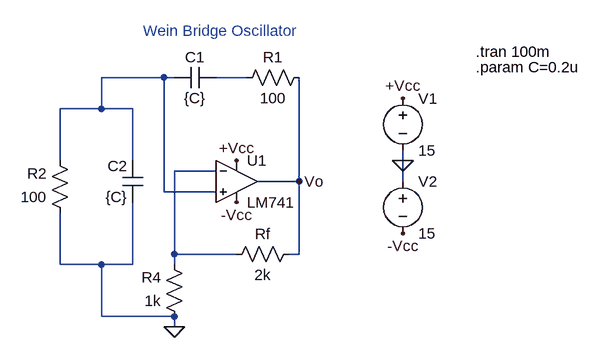
[diagram p0: schematic Wein Bridge.asc]
Wein Bridge.asc, the LTspice schematic file:
Version 4
SHEET 1 880 680
WIRE 96 0 0 0
WIRE 112 0 96 0
WIRE 224 0 176 0
WIRE 0 48 0 0
WIRE 0 48 -64 48
WIRE 48 48 0 48
WIRE -64 128 -64 48
WIRE 48 128 48 48
WIRE 464 128 464 112
WIRE 176 144 112 144
WIRE 304 160 304 0
WIRE 304 160 240 160
WIRE 464 160 464 128
WIRE 96 176 96 0
WIRE 176 176 96 176
WIRE 112 272 112 144
WIRE 208 272 112 272
WIRE 304 272 304 160
WIRE 304 272 288 272
WIRE -64 288 -64 208
WIRE 0 288 -64 288
WIRE 48 288 48 192
WIRE 48 288 0 288
WIRE 112 288 112 272
WIRE 0 368 0 288
WIRE 112 368 0 368
WIRE 112 384 112 368
FLAG 464 128 0
FLAG 464 32 +Vcc
FLAG 208 128 +Vcc
FLAG 464 240 -Vcc
FLAG 208 192 -Vcc
FLAG 304 160 Vo
FLAG 112 384 0
SYMBOL Opamps\\LM741 208 96 R0
SYMATTR InstName U1
SYMBOL voltage 464 16 R0
SYMATTR InstName V1
SYMATTR Value 15
SYMBOL voltage 464 144 R0
SYMATTR InstName V2
SYMATTR Value 15
SYMBOL cap 176 -16 R90
WINDOW 0 0 32 VBottom 2
WINDOW 3 32 32 VTop 2
SYMATTR InstName C1
SYMATTR Value {C}
SYMBOL cap 64 192 R180
WINDOW 0 24 56 Left 2
WINDOW 3 24 8 Left 2
SYMATTR InstName C2
SYMATTR Value {C}
SYMBOL res 320 -16 R90
WINDOW 0 0 56 VBottom 2
WINDOW 3 32 56 VTop 2
SYMATTR InstName R1
SYMATTR Value 100
SYMBOL res -48 224 R180
WINDOW 0 36 76 Left 2
WINDOW 3 36 40 Left 2
SYMATTR InstName R2
SYMATTR Value 100
SYMBOL res 304 256 R90
WINDOW 0 0 56 VBottom 2
WINDOW 3 32 56 VTop 2
SYMATTR InstName Rf
SYMATTR Value 2k
SYMBOL res 128 384 R180
WINDOW 0 36 76 Left 2
WINDOW 3 36 40 Left 2
SYMATTR InstName R4
SYMATTR Value 1k
TEXT 576 -40 Left 2 !.tran 100m
TEXT 576 -16 Left 2 !.param C=0.2u
TEXT 64 -72 Left 2 ;Wein Bridge Oscillator

The netlist it stands for:
* Wein Bridge.asc
XU1 N001 N003 +Vcc -Vcc Vo LM741  ; pins In+ In- V+ V- OUT
V1 +Vcc 0 15
V2 0 -Vcc 15
C1 N002 N001 {C}
C2 0 N001 {C}
R1 Vo N002 100
R2 0 N001 100
Rf Vo N003 2k
R4 0 N003 1k
.tran 100m
.param C=0.2u
* Wein Bridge Oscillator
.lib LM741.lib
.backanno
.end